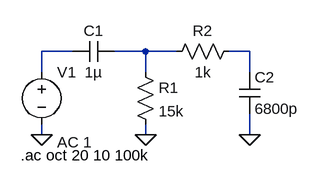
[diagram p0: schematic FV01_Output_Filter.asc]
FV01_Output_Filter.asc, the LTspice schematic file:
Version 4
SHEET 1 880 680
WIRE 128 128 80 128
WIRE 240 128 192 128
WIRE 288 128 240 128
WIRE 400 128 368 128
WIRE 80 160 80 128
WIRE 240 160 240 128
WIRE 400 160 400 128
WIRE 80 256 80 240
WIRE 240 256 240 240
WIRE 400 256 400 224
FLAG 80 256 0
FLAG 240 256 0
FLAG 400 256 0
SYMBOL cap 192 112 R90
WINDOW 0 0 32 VBottom 2
WINDOW 3 32 32 VTop 2
SYMATTR InstName C1
SYMATTR Value 1µ
SYMBOL res 224 144 R0
SYMATTR InstName R1
SYMATTR Value 15k
SYMBOL res 384 112 R90
WINDOW 0 0 56 VBottom 2
WINDOW 3 32 56 VTop 2
SYMATTR InstName R2
SYMATTR Value 1k
SYMBOL cap 384 160 R0
SYMATTR InstName C2
SYMATTR Value 6800p
SYMBOL voltage 80 144 R0
WINDOW 123 24 124 Left 2
WINDOW 39 0 0 Left 0
SYMATTR Value2 AC 1
SYMATTR InstName V1
SYMATTR Value ""
TEXT 48 288 Left 2 !.ac oct 20 10 100k

The netlist it stands for:
* FV01_Output_Filter.asc
C1 N002 N001 1µ
R1 N002 0 15k
R2 N003 N002 1k
C2 N003 0 6800p
V1 N001 0 AC 1
.ac oct 20 10 100k
.backanno
.end